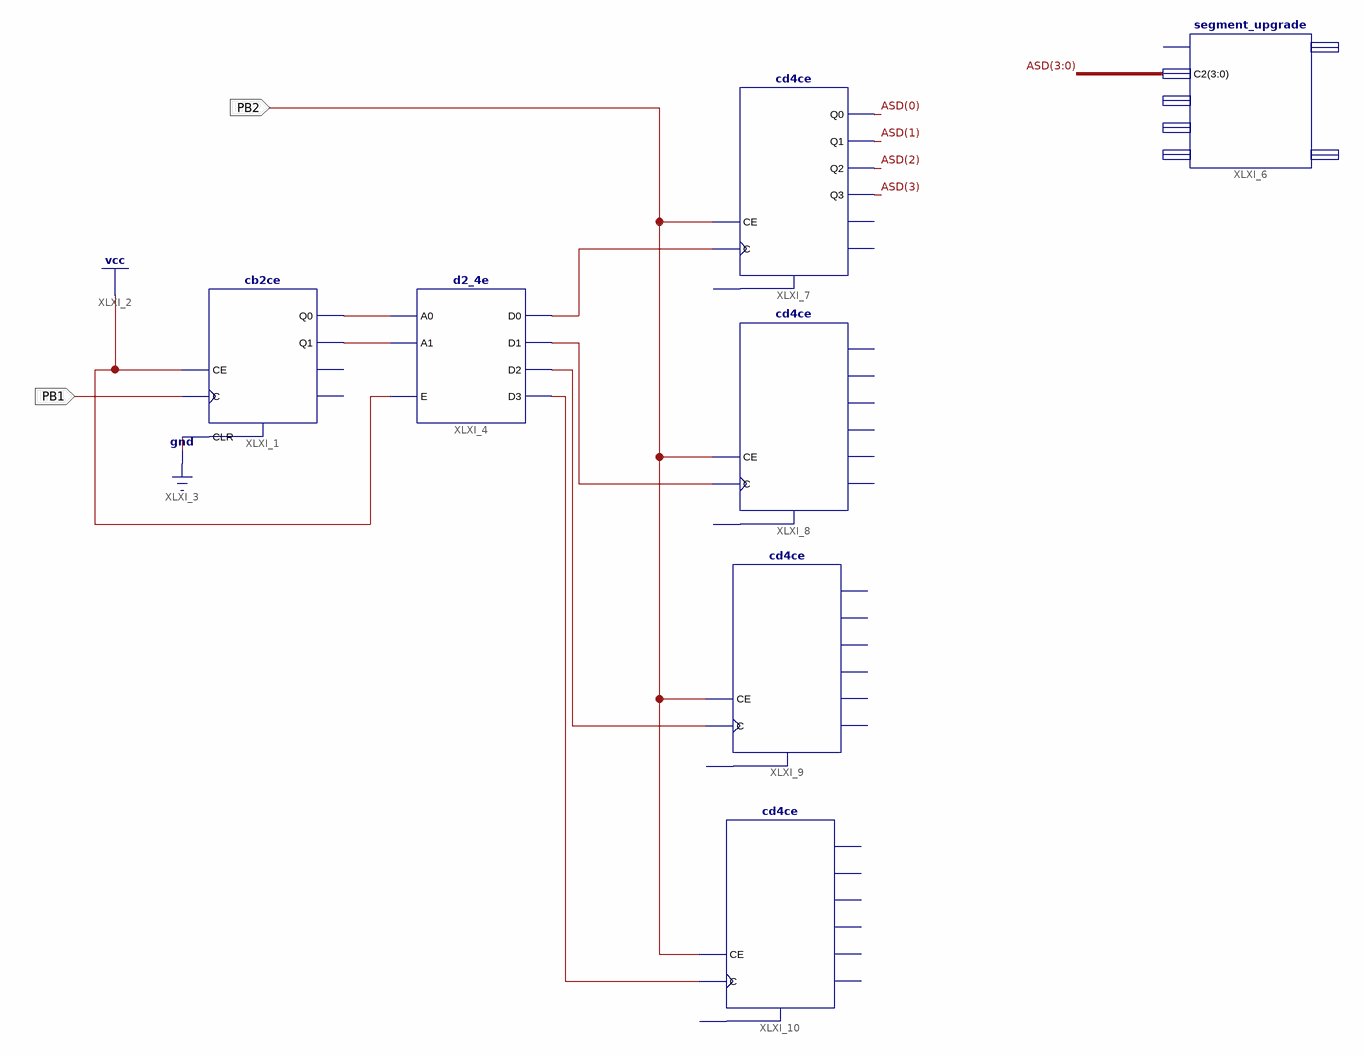
[diagram p0: schematic sheet 1]
// Xilinx ISE schematic main.sch (spartan6) as structural Verilog: 7 symbols, 2 ports
module main (
  input  PB1,
  input  PB2
);

  wire L0, L1, L2, L3, XLXN_4, XLXN_5;
  wire [3:0] ASD;

  cb2ce XLXI_1 (.C(PB1), .CE(1'b1), .CLR(1'b0), .Q0(XLXN_4), .Q1(XLXN_5));  // open: CEO, TC
  d2_4e XLXI_4 (.A0(XLXN_4), .A1(XLXN_5), .E(1'b1), .D0(L0), .D1(L1), .D2(L2), .D3(L3));
  segment_upgrade XLXI_6 (.C2(ASD));  // open: CLK_P123, C1, C3, C4, SEG_OUT, COMM
  cd4ce XLXI_7 (.C(L0), .CE(PB2), .Q0(ASD[0]), .Q1(ASD[1]), .Q2(ASD[2]), .Q3(ASD[3]));  // open: CLR, CEO, TC
  cd4ce XLXI_8 (.C(L1), .CE(PB2));  // open: CLR, CEO, Q0, Q1, Q2, Q3, TC
  cd4ce XLXI_9 (.C(L2), .CE(PB2));  // open: CLR, CEO, Q0, Q1, Q2, Q3, TC
  cd4ce XLXI_10 (.C(L3), .CE(PB2));  // open: CLR, CEO, Q0, Q1, Q2, Q3, TC
endmodule
